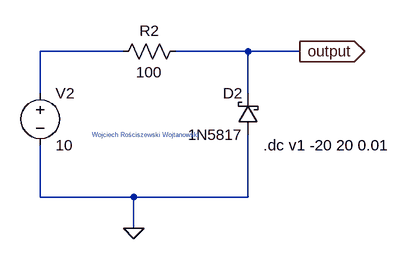
[diagram p0: schematic Characteristic of semiconductor Shottky diode.asc]
Characteristic of semiconductor Shottky diode.asc, the LTspice schematic file:
Version 4
SHEET 1 972 680
WIRE 544 -368 416 -368
WIRE 736 -368 624 -368
WIRE 816 -368 736 -368
WIRE 416 -304 416 -368
WIRE 736 -304 736 -368
WIRE 416 -144 416 -224
WIRE 560 -144 416 -144
WIRE 736 -144 736 -240
WIRE 736 -144 560 -144
WIRE 560 -96 560 -144
FLAG 560 -96 0
FLAG 816 -368 output
IOPIN 816 -368 Out
SYMBOL res 640 -384 R90
WINDOW 0 0 56 VBottom 2
WINDOW 3 32 56 VTop 2
SYMATTR InstName R2
SYMATTR Value 100
SYMBOL schottky 752 -240 R180
WINDOW 0 24 64 Left 2
WINDOW 3 24 0 Left 2
SYMATTR InstName D2
SYMATTR Value 1N5817
SYMATTR Description Diode
SYMATTR Type diode
SYMBOL voltage 416 -320 R0
WINDOW 123 0 0 Left 0
WINDOW 39 0 0 Left 0
SYMATTR InstName V2
SYMATTR Value 10
TEXT 496 -240 Left 0 ;Wojciech Rościszewski Wojtanowski
TEXT 760 -224 Left 2 !.dc v1 -20 20 0.01

The netlist it stands for:
* Characteristic of semiconductor Shottky diode.asc
R2 output N001 100
D2 0 output 1N5817
V2 N001 0 10
.model D D
.lib standard.dio
* Wojciech Rościszewski Wojtanowski
.dc v1 -20 20 0.01
.backanno
.end